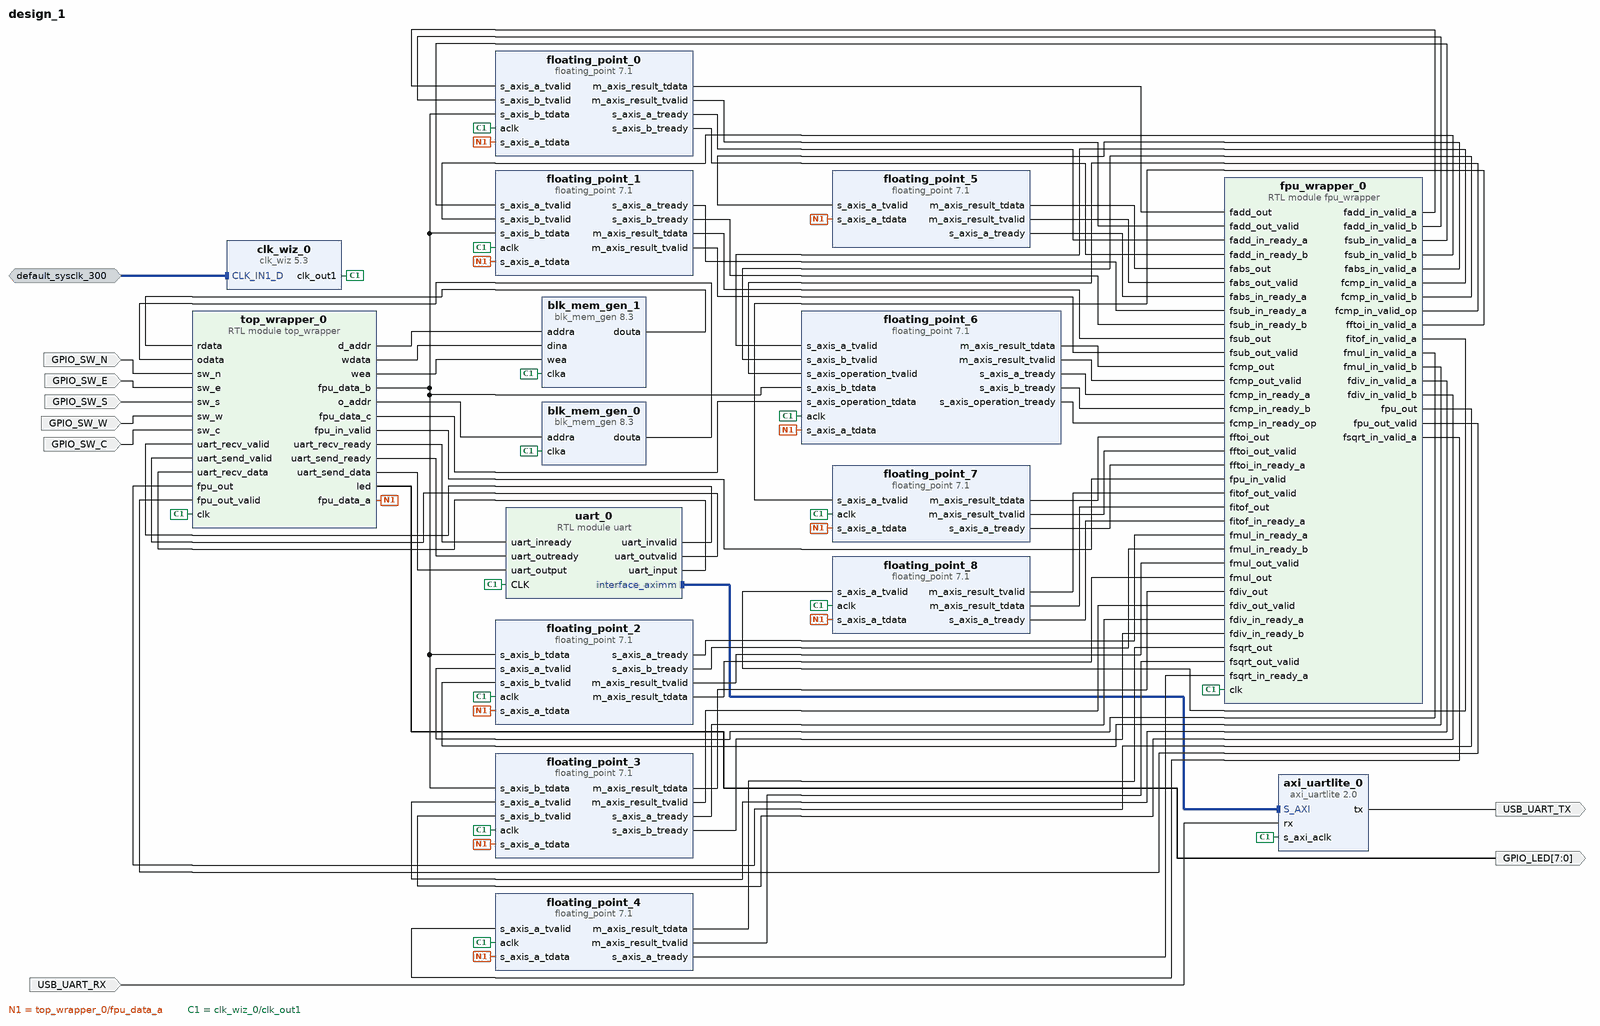
[diagram p0: block diagram of the top level]
# Vivado block design design_1, xcku040-ffva1156-2-e, Vivado 2016.4
create_bd_design design_1

create_bd_intf_port -mode Slave -vlnv xilinx.com:interface:diff_clock_rtl:1.0 default_sysclk_300
set_property -dict {CONFIG.FREQ_HZ 300000000} [get_bd_intf_ports default_sysclk_300]
create_bd_port -dir O -from 7 -to 0 -type data GPIO_LED
create_bd_port -dir I -type data GPIO_SW_N
create_bd_port -dir I -type data GPIO_SW_E
create_bd_port -dir I GPIO_SW_S
create_bd_port -dir I -type data GPIO_SW_W
create_bd_port -dir I -type data GPIO_SW_C
create_bd_port -dir O -type data USB_UART_TX
create_bd_port -dir I -type data USB_UART_RX

create_bd_cell -type ip -vlnv xilinx.com:ip:floating_point:7.1 floating_point_0
set_property -dict [list \
  CONFIG.Add_Sub_Value Add \
  CONFIG.Has_RESULT_TREADY false \
  CONFIG.Maximum_Latency false \
  CONFIG.C_Latency 4 \
] [get_bd_cells floating_point_0]
create_bd_cell -type ip -vlnv xilinx.com:ip:floating_point:7.1 floating_point_1
set_property -dict [list \
  CONFIG.Add_Sub_Value Subtract \
  CONFIG.Has_RESULT_TREADY false \
  CONFIG.Maximum_Latency false \
  CONFIG.C_Latency 4 \
] [get_bd_cells floating_point_1]
create_bd_cell -type ip -vlnv xilinx.com:ip:floating_point:7.1 floating_point_2
set_property -dict [list \
  CONFIG.Operation_Type Multiply \
  CONFIG.Result_Precision_Type Single \
  CONFIG.C_Result_Exponent_Width 8 \
  CONFIG.C_Result_Fraction_Width 24 \
  CONFIG.C_Mult_Usage Full_Usage \
  CONFIG.Has_RESULT_TREADY false \
  CONFIG.Maximum_Latency false \
  CONFIG.C_Latency 3 \
  CONFIG.C_Rate 1 \
] [get_bd_cells floating_point_2]
create_bd_cell -type ip -vlnv xilinx.com:ip:floating_point:7.1 floating_point_3
set_property -dict [list \
  CONFIG.Operation_Type Divide \
  CONFIG.Result_Precision_Type Single \
  CONFIG.C_Result_Exponent_Width 8 \
  CONFIG.C_Result_Fraction_Width 24 \
  CONFIG.C_Mult_Usage No_Usage \
  CONFIG.Has_RESULT_TREADY false \
  CONFIG.Maximum_Latency false \
  CONFIG.C_Latency 10 \
  CONFIG.C_Rate 1 \
] [get_bd_cells floating_point_3]
create_bd_cell -type ip -vlnv xilinx.com:ip:floating_point:7.1 floating_point_4
set_property -dict [list \
  CONFIG.Operation_Type Square_root \
  CONFIG.Result_Precision_Type Single \
  CONFIG.C_Result_Exponent_Width 8 \
  CONFIG.C_Result_Fraction_Width 24 \
  CONFIG.C_Mult_Usage No_Usage \
  CONFIG.Has_RESULT_TREADY false \
  CONFIG.Maximum_Latency false \
  CONFIG.C_Latency 10 \
  CONFIG.C_Rate 1 \
] [get_bd_cells floating_point_4]
create_bd_cell -type ip -vlnv xilinx.com:ip:floating_point:7.1 floating_point_5
set_property -dict [list \
  CONFIG.Operation_Type Absolute \
  CONFIG.Result_Precision_Type Single \
  CONFIG.C_Result_Exponent_Width 8 \
  CONFIG.C_Result_Fraction_Width 24 \
  CONFIG.C_Mult_Usage No_Usage \
  CONFIG.Has_RESULT_TREADY false \
  CONFIG.C_Latency 0 \
  CONFIG.C_Rate 1 \
] [get_bd_cells floating_point_5]
create_bd_cell -type ip -vlnv xilinx.com:ip:floating_point:7.1 floating_point_6
set_property -dict [list \
  CONFIG.Operation_Type Compare \
  CONFIG.Result_Precision_Type Custom \
  CONFIG.C_Result_Exponent_Width 1 \
  CONFIG.C_Result_Fraction_Width 0 \
  CONFIG.C_Mult_Usage No_Usage \
  CONFIG.Has_RESULT_TREADY false \
  CONFIG.Maximum_Latency false \
  CONFIG.C_Latency 1 \
  CONFIG.C_Rate 1 \
] [get_bd_cells floating_point_6]
create_bd_cell -type ip -vlnv xilinx.com:ip:floating_point:7.1 floating_point_7
set_property -dict [list \
  CONFIG.Operation_Type Float_to_fixed \
  CONFIG.Result_Precision_Type Int32 \
  CONFIG.C_Result_Exponent_Width 32 \
  CONFIG.C_Result_Fraction_Width 0 \
  CONFIG.C_Mult_Usage No_Usage \
  CONFIG.Has_RESULT_TREADY false \
  CONFIG.Maximum_Latency false \
  CONFIG.C_Latency 2 \
  CONFIG.C_Rate 1 \
] [get_bd_cells floating_point_7]
create_bd_cell -type ip -vlnv xilinx.com:ip:floating_point:7.1 floating_point_8
set_property -dict [list \
  CONFIG.Operation_Type Fixed_to_float \
  CONFIG.Result_Precision_Type Single \
  CONFIG.C_Result_Exponent_Width 8 \
  CONFIG.C_Result_Fraction_Width 24 \
  CONFIG.C_Accum_Msb 32 \
  CONFIG.C_Accum_Lsb -31 \
  CONFIG.C_Accum_Input_Msb 32 \
  CONFIG.C_Mult_Usage No_Usage \
  CONFIG.Has_RESULT_TREADY false \
  CONFIG.Maximum_Latency false \
  CONFIG.C_Latency 2 \
  CONFIG.C_Rate 1 \
] [get_bd_cells floating_point_8]
create_bd_cell -type ip -vlnv xilinx.com:ip:clk_wiz:5.3 clk_wiz_0
set_property -dict {CONFIG.USE_BOARD_FLOW true CONFIG.CLK_IN1_BOARD_INTERFACE default_sysclk_300} [get_bd_cells clk_wiz_0]
create_bd_cell -type ip -vlnv xilinx.com:ip:blk_mem_gen:8.3 blk_mem_gen_0
set_property -dict [list \
  CONFIG.Enable_32bit_Address false \
  CONFIG.Use_Byte_Write_Enable false \
  CONFIG.Enable_A Always_Enabled \
  CONFIG.Register_PortA_Output_of_Memory_Primitives false \
  CONFIG.Load_Init_File true \
  CONFIG.Coe_File ../../../../../../../min-rt.coe \
  CONFIG.Use_RSTA_Pin false \
  CONFIG.use_bram_block Stand_Alone \
] [get_bd_cells blk_mem_gen_0]
create_bd_cell -type ip -vlnv xilinx.com:ip:blk_mem_gen:8.3 blk_mem_gen_1
set_property -dict [list \
  CONFIG.Enable_32bit_Address false \
  CONFIG.Use_Byte_Write_Enable false \
  CONFIG.Enable_A Always_Enabled \
  CONFIG.Register_PortA_Output_of_Memory_Primitives false \
  CONFIG.Use_RSTA_Pin false \
  CONFIG.use_bram_block Stand_Alone \
] [get_bd_cells blk_mem_gen_1]
create_bd_cell -type module -reference fpu_wrapper fpu_wrapper_0
create_bd_cell -type ip -vlnv xilinx.com:ip:axi_uartlite:2.0 axi_uartlite_0
create_bd_cell -type module -reference uart uart_0
create_bd_cell -type module -reference top_wrapper top_wrapper_0

# ---- connections ----

connect_bd_intf_net [get_bd_intf_pins uart_0/interface_aximm] [get_bd_intf_pins axi_uartlite_0/S_AXI]
connect_bd_intf_net -intf_net default_sysclk_300_1 [get_bd_intf_ports default_sysclk_300] [get_bd_intf_pins clk_wiz_0/CLK_IN1_D]
connect_bd_net [get_bd_pins top_wrapper_0/fpu_data_a] \
  [get_bd_pins floating_point_0/s_axis_a_tdata] [get_bd_pins floating_point_1/s_axis_a_tdata] \
  [get_bd_pins floating_point_2/s_axis_a_tdata] [get_bd_pins floating_point_3/s_axis_a_tdata] \
  [get_bd_pins floating_point_4/s_axis_a_tdata] [get_bd_pins floating_point_5/s_axis_a_tdata] \
  [get_bd_pins floating_point_6/s_axis_a_tdata] [get_bd_pins floating_point_7/s_axis_a_tdata] \
  [get_bd_pins floating_point_8/s_axis_a_tdata]
connect_bd_net [get_bd_pins floating_point_0/m_axis_result_tdata] [get_bd_pins fpu_wrapper_0/fadd_out]
connect_bd_net [get_bd_pins floating_point_0/m_axis_result_tvalid] [get_bd_pins fpu_wrapper_0/fadd_out_valid]
connect_bd_net [get_bd_pins fpu_wrapper_0/fadd_in_valid_a] [get_bd_pins floating_point_0/s_axis_a_tvalid]
connect_bd_net [get_bd_pins floating_point_0/s_axis_a_tready] [get_bd_pins fpu_wrapper_0/fadd_in_ready_a]
connect_bd_net [get_bd_pins floating_point_0/s_axis_b_tready] [get_bd_pins fpu_wrapper_0/fadd_in_ready_b]
connect_bd_net [get_bd_pins floating_point_1/s_axis_a_tready] [get_bd_pins fpu_wrapper_0/fsub_in_ready_a]
connect_bd_net [get_bd_pins floating_point_1/s_axis_b_tready] [get_bd_pins fpu_wrapper_0/fsub_in_ready_b]
connect_bd_net [get_bd_pins floating_point_1/m_axis_result_tdata] [get_bd_pins fpu_wrapper_0/fsub_out]
connect_bd_net [get_bd_pins floating_point_1/m_axis_result_tvalid] [get_bd_pins fpu_wrapper_0/fsub_out_valid]
connect_bd_net [get_bd_pins fpu_wrapper_0/fadd_in_valid_b] [get_bd_pins floating_point_0/s_axis_b_tvalid]
connect_bd_net [get_bd_pins fpu_wrapper_0/fsub_in_valid_a] [get_bd_pins floating_point_1/s_axis_a_tvalid]
connect_bd_net [get_bd_pins fpu_wrapper_0/fsub_in_valid_b] [get_bd_pins floating_point_1/s_axis_b_tvalid]
connect_bd_net [get_bd_pins fpu_wrapper_0/fmul_in_valid_a] [get_bd_pins floating_point_2/s_axis_a_tvalid]
connect_bd_net [get_bd_pins fpu_wrapper_0/fmul_in_valid_b] [get_bd_pins floating_point_2/s_axis_b_tvalid]
connect_bd_net [get_bd_pins floating_point_2/s_axis_a_tready] [get_bd_pins fpu_wrapper_0/fmul_in_ready_a]
connect_bd_net [get_bd_pins floating_point_2/s_axis_b_tready] [get_bd_pins fpu_wrapper_0/fmul_in_ready_b]
connect_bd_net [get_bd_pins floating_point_2/m_axis_result_tvalid] [get_bd_pins fpu_wrapper_0/fmul_out_valid]
connect_bd_net [get_bd_pins floating_point_3/m_axis_result_tdata] [get_bd_pins fpu_wrapper_0/fdiv_out]
connect_bd_net [get_bd_pins floating_point_3/m_axis_result_tvalid] [get_bd_pins fpu_wrapper_0/fdiv_out_valid]
connect_bd_net [get_bd_pins floating_point_3/s_axis_a_tready] [get_bd_pins fpu_wrapper_0/fdiv_in_ready_a]
connect_bd_net [get_bd_pins floating_point_3/s_axis_b_tready] [get_bd_pins fpu_wrapper_0/fdiv_in_ready_b]
connect_bd_net [get_bd_pins fpu_wrapper_0/fdiv_in_valid_a] [get_bd_pins floating_point_3/s_axis_a_tvalid]
connect_bd_net [get_bd_pins fpu_wrapper_0/fdiv_in_valid_b] [get_bd_pins floating_point_3/s_axis_b_tvalid]
connect_bd_net [get_bd_pins floating_point_4/m_axis_result_tdata] [get_bd_pins fpu_wrapper_0/fsqrt_out]
connect_bd_net [get_bd_pins floating_point_4/m_axis_result_tvalid] [get_bd_pins fpu_wrapper_0/fsqrt_out_valid]
connect_bd_net [get_bd_pins fpu_wrapper_0/fsqrt_in_valid_a] [get_bd_pins floating_point_4/s_axis_a_tvalid]
connect_bd_net [get_bd_pins floating_point_4/s_axis_a_tready] [get_bd_pins fpu_wrapper_0/fsqrt_in_ready_a]
connect_bd_net [get_bd_pins floating_point_2/m_axis_result_tdata] [get_bd_pins fpu_wrapper_0/fmul_out]
connect_bd_net [get_bd_pins floating_point_5/m_axis_result_tdata] [get_bd_pins fpu_wrapper_0/fabs_out]
connect_bd_net [get_bd_pins floating_point_5/m_axis_result_tvalid] [get_bd_pins fpu_wrapper_0/fabs_out_valid]
connect_bd_net [get_bd_pins floating_point_5/s_axis_a_tready] [get_bd_pins fpu_wrapper_0/fabs_in_ready_a]
connect_bd_net [get_bd_pins fpu_wrapper_0/fabs_in_valid_a] [get_bd_pins floating_point_5/s_axis_a_tvalid]
connect_bd_net [get_bd_pins floating_point_6/m_axis_result_tdata] [get_bd_pins fpu_wrapper_0/fcmp_out]
connect_bd_net [get_bd_pins floating_point_6/m_axis_result_tvalid] [get_bd_pins fpu_wrapper_0/fcmp_out_valid]
connect_bd_net [get_bd_pins floating_point_6/s_axis_a_tready] [get_bd_pins fpu_wrapper_0/fcmp_in_ready_a]
connect_bd_net [get_bd_pins floating_point_6/s_axis_b_tready] [get_bd_pins fpu_wrapper_0/fcmp_in_ready_b]
connect_bd_net [get_bd_pins floating_point_6/s_axis_operation_tready] [get_bd_pins fpu_wrapper_0/fcmp_in_ready_op]
connect_bd_net [get_bd_pins fpu_wrapper_0/fcmp_in_valid_a] [get_bd_pins floating_point_6/s_axis_a_tvalid]
connect_bd_net [get_bd_pins fpu_wrapper_0/fcmp_in_valid_b] [get_bd_pins floating_point_6/s_axis_b_tvalid]
connect_bd_net [get_bd_pins fpu_wrapper_0/fcmp_in_valid_op] [get_bd_pins floating_point_6/s_axis_operation_tvalid]
connect_bd_net [get_bd_pins top_wrapper_0/fpu_data_c] [get_bd_pins floating_point_6/s_axis_operation_tdata]
connect_bd_net [get_bd_pins floating_point_7/m_axis_result_tdata] [get_bd_pins fpu_wrapper_0/fftoi_out]
connect_bd_net [get_bd_pins floating_point_7/m_axis_result_tvalid] [get_bd_pins fpu_wrapper_0/fftoi_out_valid]
connect_bd_net [get_bd_pins floating_point_7/s_axis_a_tready] [get_bd_pins fpu_wrapper_0/fftoi_in_ready_a]
connect_bd_net [get_bd_pins fpu_wrapper_0/fftoi_in_valid_a] [get_bd_pins floating_point_7/s_axis_a_tvalid]
connect_bd_net [get_bd_pins fpu_wrapper_0/fitof_in_valid_a] [get_bd_pins floating_point_8/s_axis_a_tvalid]
connect_bd_net [get_bd_pins floating_point_8/m_axis_result_tvalid] [get_bd_pins fpu_wrapper_0/fitof_out_valid]
connect_bd_net [get_bd_pins floating_point_8/m_axis_result_tdata] [get_bd_pins fpu_wrapper_0/fitof_out]
connect_bd_net [get_bd_pins clk_wiz_0/clk_out1] \
  [get_bd_pins floating_point_0/aclk] [get_bd_pins floating_point_1/aclk] [get_bd_pins floating_point_2/aclk] \
  [get_bd_pins floating_point_3/aclk] [get_bd_pins floating_point_4/aclk] [get_bd_pins floating_point_6/aclk] \
  [get_bd_pins floating_point_7/aclk] [get_bd_pins floating_point_8/aclk] [get_bd_pins blk_mem_gen_0/clka] \
  [get_bd_pins blk_mem_gen_1/clka] [get_bd_pins fpu_wrapper_0/clk] [get_bd_pins axi_uartlite_0/s_axi_aclk] \
  [get_bd_pins uart_0/CLK] [get_bd_pins top_wrapper_0/clk]
connect_bd_net [get_bd_pins top_wrapper_0/fpu_in_valid] [get_bd_pins fpu_wrapper_0/fpu_in_valid]
connect_bd_net [get_bd_pins fpu_wrapper_0/fpu_out] [get_bd_pins top_wrapper_0/fpu_out]
connect_bd_net [get_bd_pins fpu_wrapper_0/fpu_out_valid] [get_bd_pins top_wrapper_0/fpu_out_valid]
connect_bd_net [get_bd_pins top_wrapper_0/o_addr] [get_bd_pins blk_mem_gen_0/addra]
connect_bd_net [get_bd_pins blk_mem_gen_0/douta] [get_bd_pins top_wrapper_0/odata]
connect_bd_net [get_bd_pins top_wrapper_0/d_addr] [get_bd_pins blk_mem_gen_1/addra]
connect_bd_net [get_bd_pins top_wrapper_0/wdata] [get_bd_pins blk_mem_gen_1/dina]
connect_bd_net [get_bd_pins blk_mem_gen_1/douta] [get_bd_pins top_wrapper_0/rdata]
connect_bd_net [get_bd_pins top_wrapper_0/wea] [get_bd_pins blk_mem_gen_1/wea]
connect_bd_net [get_bd_pins top_wrapper_0/led] [get_bd_ports GPIO_LED]
connect_bd_net [get_bd_pins floating_point_8/s_axis_a_tready] [get_bd_pins fpu_wrapper_0/fitof_in_ready_a]
connect_bd_net [get_bd_ports GPIO_SW_N] [get_bd_pins top_wrapper_0/sw_n]
connect_bd_net [get_bd_ports GPIO_SW_E] [get_bd_pins top_wrapper_0/sw_e]
connect_bd_net [get_bd_ports GPIO_SW_S] [get_bd_pins top_wrapper_0/sw_s]
connect_bd_net [get_bd_ports GPIO_SW_W] [get_bd_pins top_wrapper_0/sw_w]
connect_bd_net [get_bd_pins top_wrapper_0/fpu_data_b] \
  [get_bd_pins floating_point_6/s_axis_b_tdata] [get_bd_pins floating_point_2/s_axis_b_tdata] \
  [get_bd_pins floating_point_1/s_axis_b_tdata] [get_bd_pins floating_point_0/s_axis_b_tdata] \
  [get_bd_pins floating_point_3/s_axis_b_tdata]
connect_bd_net [get_bd_ports GPIO_SW_C] [get_bd_pins top_wrapper_0/sw_c]
connect_bd_net [get_bd_pins axi_uartlite_0/tx] [get_bd_ports USB_UART_TX]
connect_bd_net [get_bd_ports USB_UART_RX] [get_bd_pins axi_uartlite_0/rx]
connect_bd_net [get_bd_pins top_wrapper_0/uart_recv_ready] [get_bd_pins uart_0/uart_inready]
connect_bd_net [get_bd_pins top_wrapper_0/uart_send_ready] [get_bd_pins uart_0/uart_outready]
connect_bd_net [get_bd_pins top_wrapper_0/uart_send_data] [get_bd_pins uart_0/uart_output]
connect_bd_net -net uart_wrapper_0_uart_invalid [get_bd_pins uart_0/uart_invalid] [get_bd_pins top_wrapper_0/uart_recv_valid]
connect_bd_net -net uart_wrapper_0_uart_outvalid [get_bd_pins uart_0/uart_outvalid] [get_bd_pins top_wrapper_0/uart_send_valid]
connect_bd_net -net uart_wrapper_0_uart_input [get_bd_pins uart_0/uart_input] [get_bd_pins top_wrapper_0/uart_recv_data]

validate_bd_design
save_bd_design
